# Altium schematic sheet xIMU_V527.SchDoc: Mini IMU Board
size A4; CompanyName: SBS; DrawnBy: PSM; Engineer: PSM; Revision: V0; SheetNumber: 1; SheetTotal: 1; Design_Number: XIMU_527
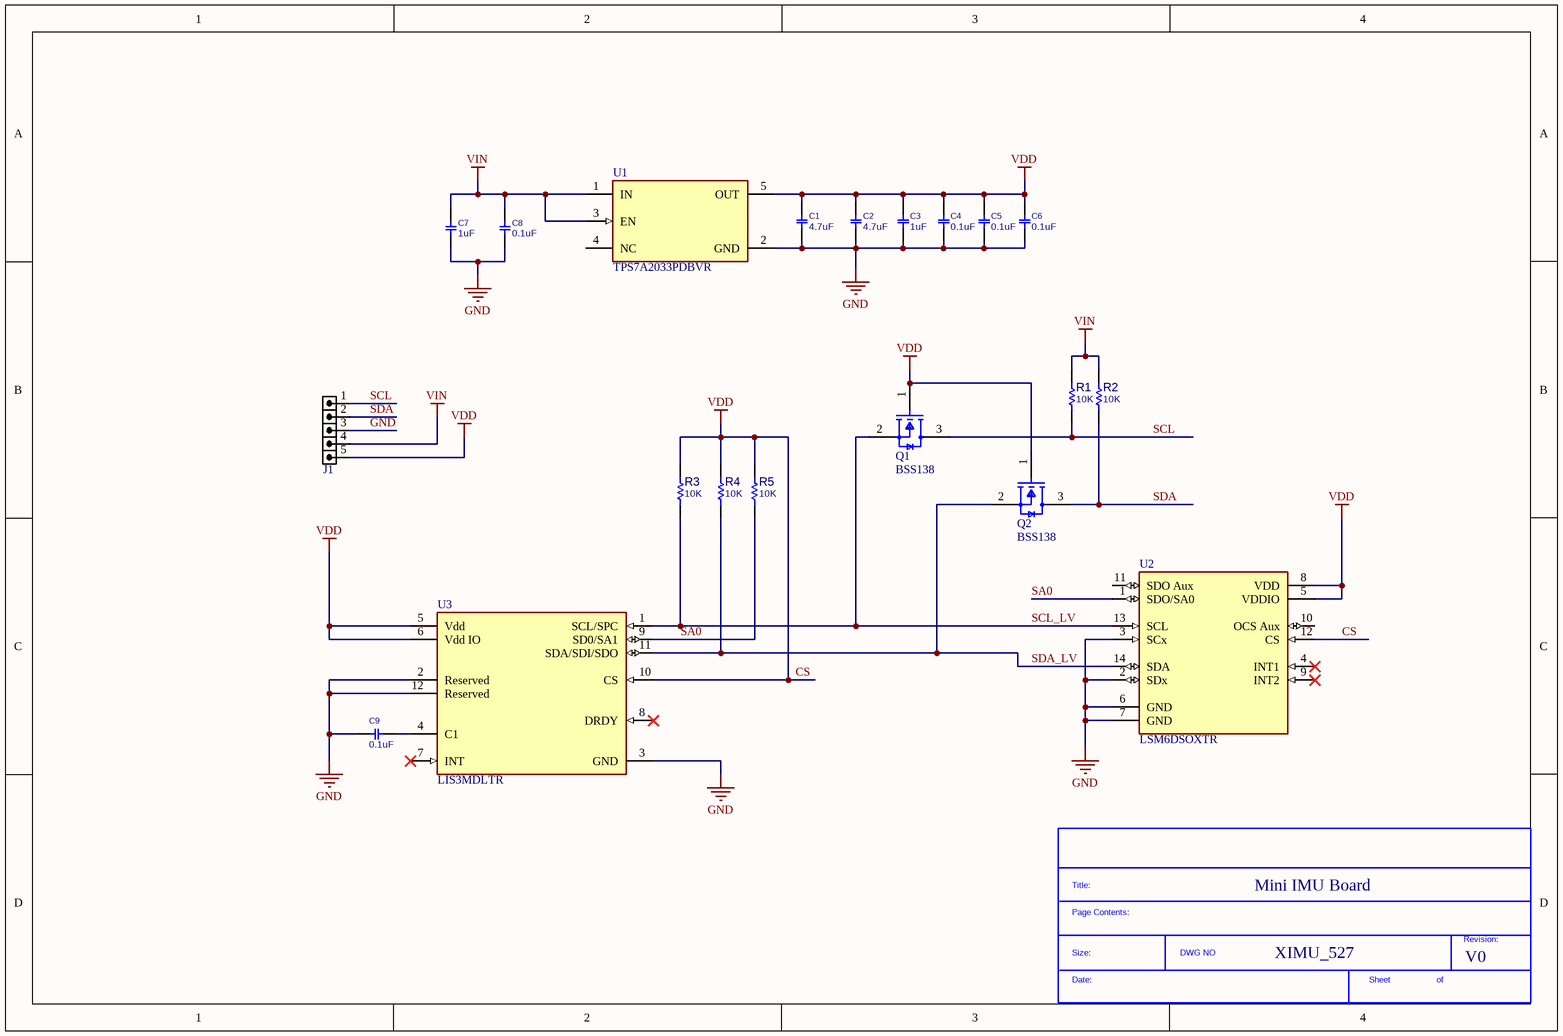
[diagram p0: xIMU_V527.SchDoc]

## Parts
*?  SDTitleBlock  (value not drawn)  (graphical)
C1  4.7uF  [C0603]
C2  4.7uF  [C0603]
C3  1uF  [C0603]
C4  0.1uF  [C0603]
C5  0.1uF  [C0603]
C6  0.1uF  [C0603]
C7  1uF  [C0603]
C8  0.1uF  [C0603]
C9  0.1uF  [C0603]
J1  HDR1X5  [xcon_5p]  (value not drawn)
Q1  BSS138  [FP-318-08-MFG]
Q2  BSS138  [FP-318-08-MFG]
R1  10K  [R0603]
R2  10K  [R0603]
R3  10K  [R0603]
R4  10K  [R0603]
R5  10K  [R0603]
U1  TPS7A2033PDBVR  [FP-DBV0005A-IPC_A]
U2  LSM6DSOXTR  [FP-LGA-14L-DM00249496-MFG]
U3  LIS3MDLTR  [FP-VFLGA-12-8365767-MFG]

## Nets
CS: C1.1 C2.1 C3.1 C4.2 C5.2 C6.2 J1.5 Q1.1(G) Q2.1(G) R3.2 R4.2 R5.2 U1.5(OUT) U2.5(VDDIO) U2.8(VDD) U2.12(CS) U3.5(Vdd) U3.6(Vdd_IO) U3.10(CS)  [also labelled VDD]
GND: C1.2 C2.2 C3.2 C4.1 C5.1 C6.1 C7.2 C8.1 C9.1 J1.3 U1.2(GND) U2.2(SDx) U2.3(SCx) U2.6(GND) U2.7(GND) U3.2(Reserved) U3.3(GND) U3.12(Reserved)
VIN: C7.1 C8.2 J1.4 R1.2 R2.2 U1.1(IN) U1.3(EN)
SA0: R5.1 U2.1(SDO/SA0) U3.9(SD0/SA1)
SCL: J1.1 Q1.3(D) R1.1
SCL_LV: Q1.2(S) R3.1 U2.13(SCL) U3.1(SCL/SPC)
SDA: J1.2 Q2.3(D) R2.1
SDA_LV: Q2.2(S) R4.1 U2.14(SDA) U3.11(SDA/SDI/SDO)
NetC9_2: C9.2 U3.4(C1)

Not connected (* = marked no-connect by the designer): U1 4(NC); U2 4(INT1)* 9(INT2)* 10(OCS_Aux) 11(SDO_Aux); U3 7(INT)* 8(DRDY)*

## Notes on the sheet
- (in symbol SDTitleBlock) Title:; Page Contents:; Revision:; Size:; DWG NO; Date:; Sheet; of

## Library data of the parts
C1 C2 = CAP_SMD_MLCC_0603: CAP, MLCC, 4.7uF, 16V, 0603, 5%, X7R; PARAM: -, -%; MANF_P#: MANF_PART#; PARAM2: -V; PRICE: 100= 1$; MANF: -; ASSEMBLY: ASSEMBLY; VALUE: 4.7uF; Supplier 1: Rs; Supplier Part Number 1: 2006547
C3 C7 = CAP_SMD_MLCC_0603: CAP, MLCC, 1uF, 16V, 0603, 5%, X7R; PARAM: -, -%; MANF_P#: MANF_PART#; PARAM2: -V; PRICE: 100= 1$; MANF: -; ASSEMBLY: ASSEMBLY; VALUE: 1uF; Supplier 1: Digikey; Supplier Part Number 1: 311-1446-1-ND
C4-C6 C8 C9 = CAP_SMD_MLCC_0603: CAP, MLCC, 0.1uF, 16V, 0603, 5%; PARAM: -, -%; MANF_P#: MANF_PART#; PARAM2: -V; PRICE: 100= 1$; MANF: -; ASSEMBLY: ASSEMBLY; VALUE: 0.1uF; Supplier 1: DigiKey; Supplier Part Number 1: 311-1088-1-ND
J1 = HDR_M_1X5: CONN, HEADER, Male, pitch: 2.54mm, 5POS; VALUE: HDRM5
Q1 Q2 = CMP-07173-000101-1: MOSFET N-CH 50V 220MA SOT-23; Turn-Off Delay Time: 20ns; Element Configuration: Single; Rds On Max: 3.5R; Gate to Source Voltage (Vgs): 20V; Threshold Voltage: 1.3V; Number of Elements: 1; Power Dissipation: 360mW; Rise Time: 9ns; Turn-On Delay Time: 2.5ns; Input Capacitance: 27pF; On-State Resistance: 6R; Lead Free: Lead Free; Length: 2.92mm; Width: 1.3mm; Drain to Source Breakdown Voltage: 50V; Min Operating Temperature: -55°C; REACH SVHC: No SVHC; Packaging: Tape and Reel; Radiation Hardening: No; Height: 0.93mm; Drain to Source Voltage (Vdss): 50V; Current Rating: 220mA; Voltage Rating (DC): 50V; Weight: 0.03g; Continuous Drain Current (ID): 220mA; Number of Pins: 3; Nominal Vgs: 1.3V; Max Power Dissipation: 360mW; Fall Time: 9ns; Drain to Source Resistance: 3.5R; Contact Plating: Tin; Case/Package: SOT-23; Package Quantity: 1; Dual Supply Voltage: 50V; Mount: Surface Mount; Termination: SMD/SMT; Max Operating Temperature: 150°C
R1-R5 = RES_SMD_0603: RESISTOR, SMD, 10K, 0603, 5%; PARAM: 1%, 0.1W; DESC: DESCRIPTION; DIST#: MOUSER; MANF_P#: -; MANF: -; ASSEMBLY: ASSEMBLY; PRICE: -; PARAM2: -; VALUE: 10K; Supplier 1: Digikey; Supplier Part Number 1: 311-10KLEDKR-ND
U1 = CMP-04917-000300-1: IC REG LINEAR 3.3V 300MA SOT23-5; RoHS Compliant: Yes
U2 = CMP-12177-000010-1: INEMO INERTIAL MODULE: 3D ACCELE; Manufacturer: STMicroelectronics; Sensor Type: Temperature,Accelerometer,Gyroscope; Accel Range: 2/4/8/16g; Accel Sensitivity: 0.061/0.122/0.244/0.488mV/g; Operating Supply Current: 0.55mA; Gyro Range: 125/250/500/1000/2000°/s; Gyro Sensitivity: 4.375/8.75/17.5/35/70LSB/°/s; Sensor Output: I2C,SPI,Other; Min Supply Voltage: 1.62V; Max Supply Voltage: 3.6V; Description: Accelerometer, Gyroscope, 6 Axis Sensor I²C, SPI Output; Octopart: https://octopart.com/lsm6dsoxtr-stmicroelectronics-98102600; Package: LGA-14L-DM00249496; Footprint Url: https://www.st.com/content/ccc/resource/technical/document/technical_note/73/17/9c/16/dd/96/4a/01/CD00134799.pdf/files/CD00134799.pdf/jcr:content/translations/en.CD00134799.pdf; ComponentLink2Description: Datasheet; Mouser Description: LSM6DSOX: 3.6 V 3 Axis Accelerometer Gyroscope iNEMO Inertial Module - LGA-14L; ComponentLink2URL: https://www.st.com/resource/en/datasheet/lsm6dsox.pdf; Temperature Range Low: -40°C; Digikey Description: INEMO INERTIAL MODULE: 3D ACCELE; Lead Free: Yes; Device Class L3: Inertial Measurement Units (IMUs); Category: IC; Device Class L2: Motion Sensors; RoHS: TRUE; Temperature: -40°C to +85°C; Height: 0.86mm; Device Class L1: Sensors; Temperature Range High: +85°C; Manufacturer Part Number: LSM6DSOXTR; Automotive: No
U3 = CMP-2000-07463-2: SENSOR MR I2C/SPI 12LGA; Manufacturer: STMicroelectronics; Sensor Output: I2C,SPI; Operating Supply Current: 40-270uA; Max Supply Voltage: 3.6V; Sensing Method: Magnetic; Min Supply Voltage: 1.71V; Description: Board Mount Hall Effect / Magnetic Sensors Ultra Lo-Pwr Hi Perf 3-Axis 1.9-3.6V; ComponentLink2URL: https://www.st.com/resource/en/datasheet/lis3mdl.pdf; Category: IC; Manufacturer Part Number: LIS3MDLTR; Octopart: https://octopart.com/lis3mdltr-stmicroelectronics-29403125; Automotive: No; ComponentLink2Description: Datasheet; RoHS: TRUE; Device Class L3: unset; Device Class L1: Sensors; Temperature: -40°C to +85°C; Height: 1mm; Mouser Description: Board Mount Hall Effect / Magnetic Sensors Ultra Lo-Pwr Hi Perf 3-Axis 1.9-3.6V; Temperature Range High: +85°C; Lead Free: Yes; Device Class L2: Magnetic Sensors; Footprint Url: https://www.st.com/content/ccc/resource/technical/document/technical_note/73/17/9c/16/dd/96/4a/01/CD00134799.pdf/files/CD00134799.pdf/jcr:content/translations/en.CD00134799.pdf; Temperature Range Low: -40°C; Package: VFLGA-12-8365767; Digikey Description: SENSOR MR I2C/SPI 12LGA